# Altium schematic sheet Output_TAB.SchDoc
size A4; SheetNumber: 8; SheetTotal: 9
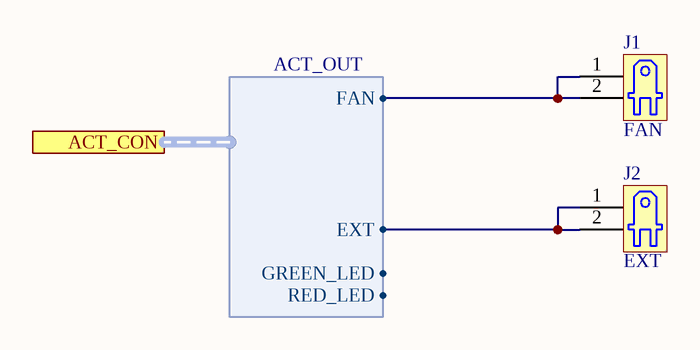
[diagram p0: Output_TAB.SchDoc]

## Parts
J1  FAN  [TAB250-250P]
J2  EXT  [TAB250-250P]

## Ports
ACT_CON (harness ACT_OUT)

## Harnesses
ACT_OUT: EXT, FAN, GREEN_LED, RED_LED

## Nets
NetJ1_1: J1.1 J1.2 ; port ACT_CON.FAN
NetJ2_1: J2.1 J2.2 ; port ACT_CON.EXT

## Library data of the parts
J1 J2 = TAB250